# EAGLE design Qwiic-CO2_Sensor-SCD40 (EAGLE 9.6.2)
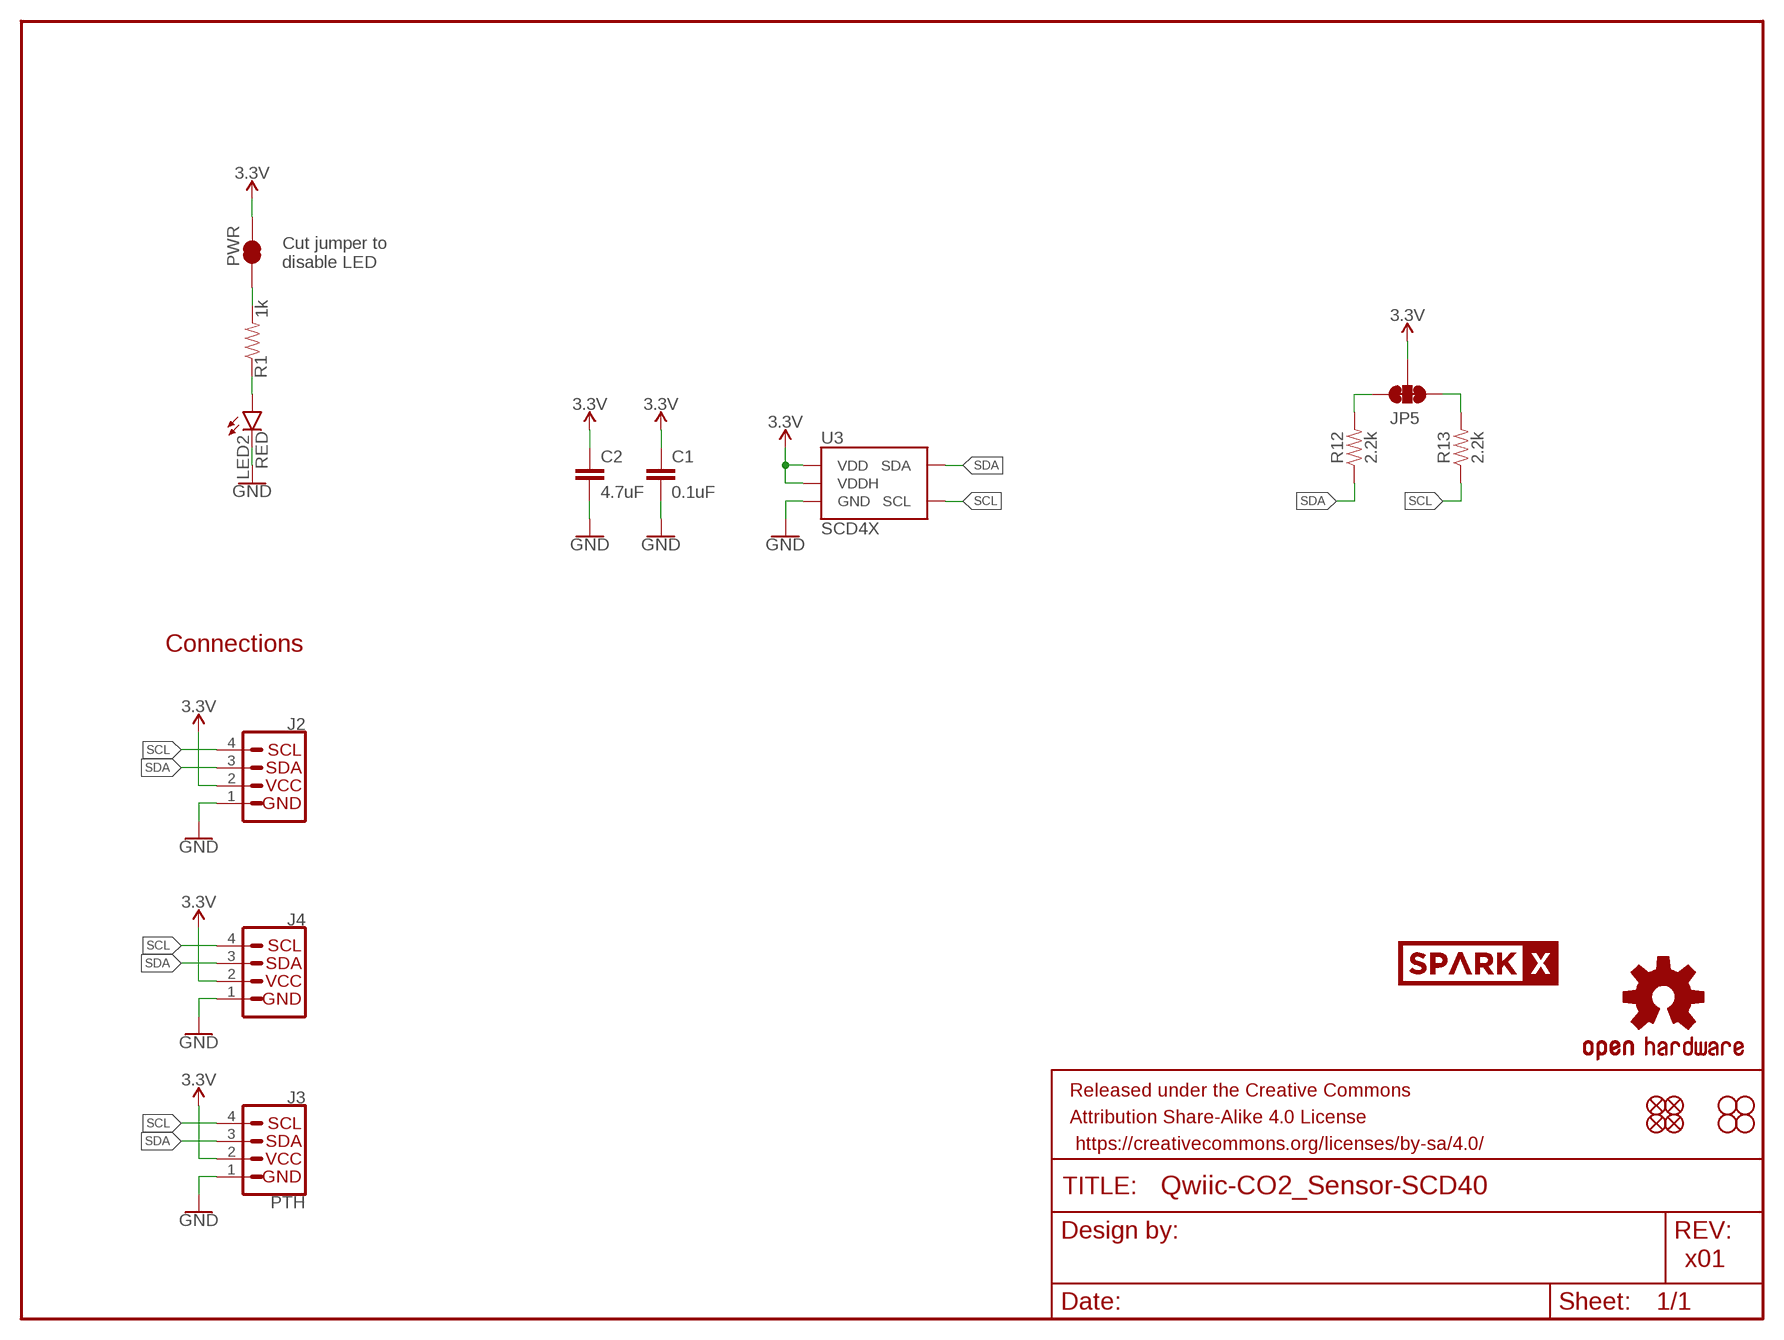
[diagram p0: schematic, sheet 1]

## Parts
C1  0.1uF  0.1UF-0603-25V-(+80/-20%)  [0603]
C2  4.7uF  4.7UF-0603-6.3V-(10%)  [0603]
FRAME1  FRAME-LETTER  [CREATIVE_COMMONS]
J2  Qwiic Right Angle  I2C_STANDARDQWIIC  [JST04_1MM_RA]
J3  PTH  I2C_STANDARD_NO_SILK  [1X04_NO_SILK]
J4  Qwiic Right Angle  I2C_STANDARDQWIIC  [JST04_1MM_RA]
JP5  JUMPER-SMT_3_2-NC_TRACE_SILK  [SMT-JUMPER_3_2-NC_TRACE_SILK]
JP21  FIDUCIALUFIDUCIAL  [MICRO-FIDUCIAL]
JP31  STAND-OFF  [STAND-OFF]
JP41  STAND-OFF  [STAND-OFF]
JP61  FIDUCIALUFIDUCIAL  [MICRO-FIDUCIAL]
JP71  FIDUCIALUFIDUCIAL  [MICRO-FIDUCIAL]
JP81  FIDUCIALUFIDUCIAL  [MICRO-FIDUCIAL]
JP91  STAND-OFF  [STAND-OFF]
JP101  STAND-OFF  [STAND-OFF]
LED2  RED  LED-RED0603  [LED-0603]
LOGO1  OSHW-LOGOMINI  [OSHW-LOGO-MINI]
PWR  JUMPER-SMT_2_NC_TRACE_SILK  [SMT-JUMPER_2_NC_TRACE_SILK]
R1  1k  1KOHM-0603-1/10W-1%  [0603]
R12  2.2k  2.2KOHM-0603-1/10W-1%  [0603]
R13  2.2k  2.2KOHM-0603-1/10W-1%  [0603]
U3  SCD4X  [SCD4X]
U$5  SPARKX-LOGO4  [SPARKX-MEDIUM]

## Nets
3.3V [3.3V]: C1.1 C2.1 J2.2 J3.2(VCC) J4.2 JP5.2 PWR.2 U3.7(VDD) U3.19(VDDH)
GND: C1.2 C2.2 J2.1 J3.1(GND) J4.1 LED2.C U3.6(GND) U3.20(GND) U3.CP(GND)
N$9: JP5.1 R13.2
N$10: LED2.A R1.1
N$15: JP5.3 R12.2
N$17: PWR.1 R1.2
SCL: J2.4 J3.4(SCL) J4.4 R13.1 U3.9(SCL)
SDA: J2.3 J3.3(SDA) J4.3 R12.1 U3.10(SDA)

## Notes on the sheet
- Cut jumper to 
  disable LED
- Connections
- x01

## Library data of the parts
C1 = SparkFun-Capacitors:0.1UF: 0.1µF ceramic capacitors A capacitor is a passive two-terminal electrical component used to store electrical energy temporarily in an electric field.; PROD_ID: CAP-00810
C2 = SparkFun-Capacitors:4.7UF: 4.7µF ceramic capacitors A capacitor is a passive two-terminal electrical component used to store electrical energy temporarily in an electric field.; PROD_ID: CAP-08280
FRAME1 = SparkFun-Aesthetics:FRAME-LETTER: Schematic Frame - Letter Standard 8.5x11 US Letter frame
J2 J4 = SparkFun-Connectors:I2C_STANDARD: SparkFun I2C Standard Pinout Header SparkFun has standardized on a pinout for all I2C based sensor breakouts. This pinout allows I2C boards to be plugged directly into the headers on Arduino Uno compatible boards, and to be daisy chained easily. Example SparkFun Products: SparkFun Atmospheric Sensor Breakout - BME280 <https://www.sparkfun.com/products/13676> SparkFun Altitude/Pressure Sensor Breakout - MPL3115A2 <https://www.sparkfun.com/products/11084> SparkFun TOF Range Finder Sensor - VL6180 <https://www.sparkfun.com/products/12785>; PROD_ID: CONN-13694
J3 = SparkX:I2C_STANDARD: SparkFun I2C Standard Pinout Header SparkFun has standardized on a pinout for all I2C based sensor breakouts. This pinout allows I2C boards to be plugged directly into the headers on Arduino Uno compatible boards, and to be daisy chained easily. Example SparkFun Products: SparkFun Atmospheric Sensor Breakout - BME280 <https://www.sparkfun.com/products/13676> SparkFun Altitude/Pressure Sensor Breakout - MPL3115A2 <https://www.sparkfun.com/products/11084> SparkFun TOF Range Finder Sensor - VL6180 <https://www.sparkfun.com/products/12785>
JP5 = SparkFun-Jumpers:JUMPER-SMT_3_2-NC_TRACE: Normally closed trace jumper (2 of 2 connections) This jumper has a trace between all three pads so they are normally closed (NC). Use a razor knife to open the connection(s). For best results follow the IPC guidelines for cutting traces: Cutout at least 0.063 mm (0.005 in). Remove all loose material to clean up the cut area. Seal the cut with an approved epoxy. Reapply solder to reclose the connection(s).
JP21 JP61 JP71 JP81 = SparkFun:FIDUCIAL: Fiducial Alignment Points Various fiducial points for machine vision alignment.
JP31 JP41 JP91 JP101 = SparkFun:STAND-OFF: Stand Off This is the mechanical footprint for a #4 phillips button head screw. Use the keepout ring to avoid running the screw head into surrounding components. SKU : PRT-00447
LED2 = SparkFun-LED:LED-RED: Red SMD LED Used in manufacturing of most products at SparkFun Packages: 0603 - SMD 0603 package [Product Link] <http://docs.avagotech.com/docs/AV02-0551EN> 0603 SMART - SMD 0603 SMART package ( more efficient and expensive)[Product Link] <http://www.osram-os.com/Graphics/XPic2/00077099_0.pdf> 1206 - SMD1206 package [Product Link] <https://www.sparkfun.com/datasheets/DevTools/LilyPad/Q150OVS4.pdff> SparkFun Products: Pro Mini 328 -5V <https://www.sparkfun.com/products/821> RedBoard <https://www.sparkfun.com/products/12757> IOIO-OTG <https://www.sparkfun.com/products/13613>; PROD_ID: DIO-00819
LOGO1 = SparkFun-Aesthetics:OSHW-LOGO: Open-Source Hardware (OSHW) Logo This logo indicates the piece of hardware it is found on incorporates a OSHW license and/or adheres to the definition of open source hardware found here: http://freedomdefined.org/OSHW
PWR = SparkFun-Jumpers:JUMPER-SMT_2_NC_TRACE: Normally closed trace jumper This jumper has a trace between two pads so it's normally closed (NC). Use a razor knife to open the connection. For best results follow the IPC guidelines for cutting traces: Cutout at least 0.063 mm (0.005 in). Remove all loose material to clean up the cut area. Seal the cut with an approved epoxy. Reapply solder to reclose the connection.
R1 = SparkFun-Resistors:1KOHM: 1kΩ resistor A resistor is a passive two-terminal electrical component that implements electrical resistance as a circuit element. Resistors act to reduce current flow, and, at the same time, act to lower voltage levels within circuits. - Wikipedia; PROD_ID: RES-07856
R12 R13 = SparkFun-Resistors:2.2KOHM: 2.2kΩ resistor A resistor is a passive two-terminal electrical component that implements electrical resistance as a circuit element. Resistors act to reduce current flow, and, at the same time, act to lower voltage levels within circuits. - Wikipedia; PROD_ID: RES-08272
U3 = NewParts:SCD4X: The SGP40 is a digital gas sensor designed for easy integration into air purifiers or demand-controlled ventilation systems.
U$5 = SparkX:SPARKX-LOGO

## Net classes
1 power: width 0.178 mm
2 3.3V: width 0.305 mm
3 RF: width 0.35 mm, clearance 0.203 mm

## Board
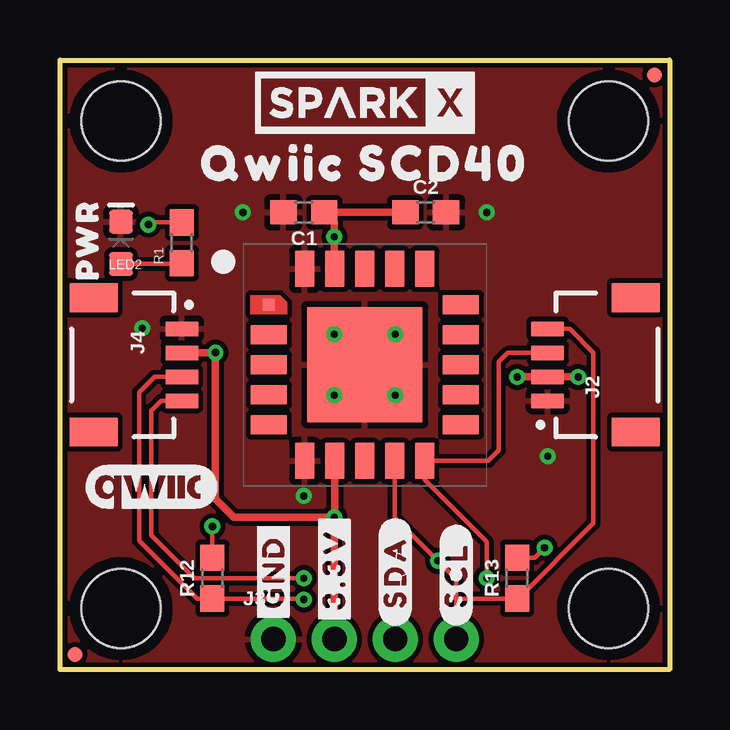
[diagram p1: board, top side]
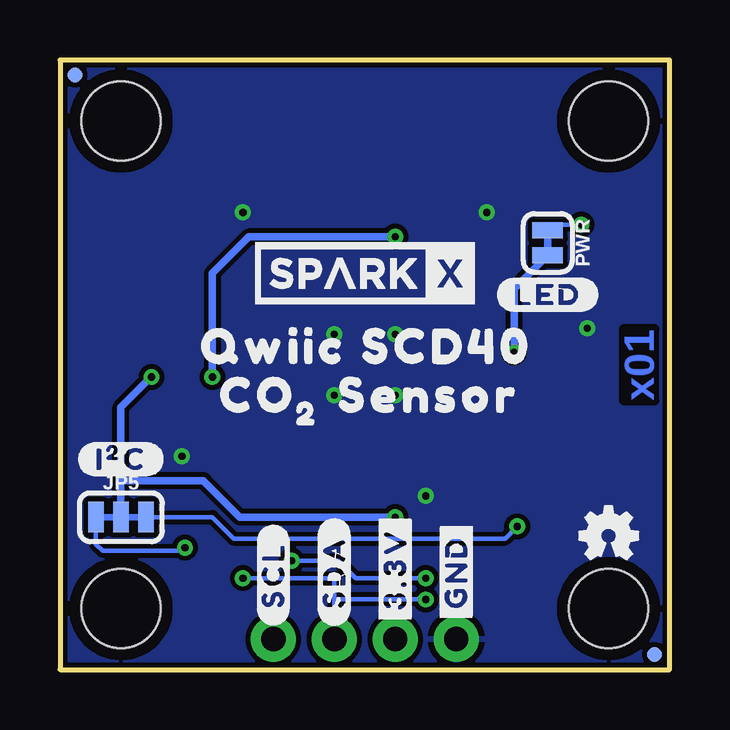
[diagram p2: board, bottom side, seen from below]

Size 25.4 x 25.4 mm. Coordinates in mm from the lower left corner, seen from the top.
Outline: 25.4,0 0,0 0,25.4 25.4,25.4 25.4,0
Copper layers (1*16): Top 0.035mm / dielectric 1.5mm / Bottom 0.035mm
Design rules "SparkFun-2-Layer-General-JLCPCB": minimum track width 7mil, minimum drill 0.3mm, track to track 7mil, track to pad 7mil, pad to pad 7mil, via to via 7mil, smd to smd 7mil, copper to edge 7mil, drill to drill 7mil, minimum pad ring 7mil, minimum via ring 7mil, stop-mask expansion 4mil, vias tented up to drill 25mil, thermal gap 10mil

### Footprints (pad centres in the part's own frame; a part is rotated, then mirrored left to right if it is on the bottom)
0603 = smd 1.1 x 1: 1 -0.85,0; 2 0.85,0
JST04_1MM_RA = smd 0.6 x 1.35: 1 -1.5,0; 2 -0.5,0; 3 0.5,0; 4 1.5,0 | smd 1.2 x 2: NC1 2.8,-3.675; NC2 -2.8,-3.675
1X04_NO_SILK = drill 1.016 pad 1.88: 1 0,0; 2 2.54,0; 3 5.08,0; 4 7.62,0
SMT-JUMPER_3_2-NC_TRACE_SILK = smd 0.66 x 1.27: 1 -1.041,0; 2 0,0; 3 1.041,0
MICRO-FIDUCIAL = smd 0.635 x 0.635: 1 0,0
STAND-OFF = hole 3.302: 0,0
LED-0603 = smd 1 x 1: A -0.877,0; C 0.877,0
SMT-JUMPER_2_NC_TRACE_SILK = smd 0.66 x 1.27: 1 -0.521,0; 2 0.521,0
SCD4X = smd 0.5 x 0.5: 1 -4,2.5 | smd 1.5 x 0.8: 2 -4,1.25; 3 -4,0; 4 -4,-1.25; 5 -4,-2.5; 11 4,-2.5; 12 4,-1.25; 13 4,0; 14 4,1.25; 15 4,2.5 | smd 0.8 x 1.5: 6 -2.5,-4; 7 -1.25,-4; 8 0,-4; 9 1.25,-4; 10 2.5,-4; 16 2.5,4; 17 1.25,4; 18 0,4; 19 -1.25,4; 20 -2.5,4 | smd 4.8 x 4.8: CP 0,0

### Placement (x,y rotation side)
C1  10.16,19.05 180 top
C2  15.24,19.05 0 top
FRAME1  8.89,-17.78 0 top  (outside the outline)
J2  20.32,12.7 90 top
J3  8.89,1.27 0 top
J4  5.08,12.7 270 top
JP5  22.86,6.35 0 bottom
JP21  24.77,24.77 90 top
JP31  2.54,2.54 90 top
JP41  2.54,22.86 90 top
JP61  0.64,0.64 90 top
JP71  24.77,24.77 270 bottom
JP81  0.64,0.64 270 bottom
JP91  22.86,2.54 90 top
JP101  22.86,22.86 90 top
LED2  2.54,17.78 90 top
LOGO1  2.54,5.59 0 bottom
PWR  5.08,17.78 270 bottom
R1  5.08,17.78 90 top
R12  6.35,3.81 90 top
R13  19.05,3.81 90 top
U3  12.7,12.7 0 top
U$1  [CO1]  17.14,11.43 0 bottom
U$2  [SCD400]  16,21.08 0 top
U$3  [QWIIC0]  8.89,21.08 0 top
U$4  [QWIIC0]  16.51,13.46 0 bottom
U$5  12.7,23.62 0 top
U$6  [#3#3V#0]  11.43,4.19 90 bottom
U$7  [#SDA#0]  13.97,4.06 90 bottom
U$8  [#SCL#0]  16.51,3.94 90 bottom
U$9  [#GND#0]  8.89,4.06 90 bottom
U$10  [#I�C#1]  22.86,8.76 0 bottom
U$11  [SCD400]  9.27,13.46 0 bottom
U$12  [PWR0]  1.14,17.91 90 top
U$13  [SENSOR3]  10.03,11.43 0 bottom
U$14  [20]  15.11,10.67 0 bottom
U$23  [#LED#0]  5.08,15.62 0 bottom
U$33  [#GND#0]  8.89,4.06 90 top
U$34  [#3#3V#0]  11.43,4.19 90 top
U$35  [#SDA#0]  13.97,4.06 90 top
U$36  [#SCL#0]  16.51,3.94 90 top
U$38  SPARKX-LOGO4  [SPARKX-MEDIUM]  12.7,16.51 0 bottom
U$42  [QWIIC_5.5MM]  3.81,7.62 0 top

### Tracks (layer width: path | path; a pad name or v marks a point on that pad's centre or on a via)
3.3V  (via drill 0.3)
  Top 0.305: J4.2 v6.47,13.2 v6.48,13.21 6.48,7.11 7.24,6.35 v11.43,6.35 | v19.05,12.19 J2.2 v21.58,12.2 v21.59,12.19 | U3.7 11.45,6.37 v11.43,6.35 | J3.2 v11.43,6.35 | C2.1 C1.1 11.43,18.63 v11.43,18.03 11.43,16.72 U3.19
  Bottom 0.305: v11.43,18.03 17.53,18.03 19.05,16.51 v19.05,12.19 | JP5.2 22.86,7.87 | 22.86,7.87 22.86,10.92 v21.59,12.19 | 22.86,7.87 19.43,7.87 17.91,6.35 v11.43,6.35 | v6.48,13.21 6.48,15.86 PWR.2
GND  (via drill 0.3)
  other vias: 3.43,14.22 10.16,7.24 11.43,13.97 13.97,13.97 13.97,11.43 11.43,11.43 20.32,8.89 7.62,19.05 17.78,19.05
  pour Top (isolate 0.203, rank 4): 0,0 0,25.4 25.4,25.4 25.4,0
  pour Bottom (isolate 0.203, rank 4): 0,0 0,25.4 25.4,25.4 25.4,0
N$9  (via drill 0.3)
  Top 0.178: v20.19,5.08 19.77,4.66 R13.2
  Bottom 0.178: JP5.1 23.9,5.23 23.62,4.95 20.32,4.95 v20.19,5.08
N$10
  Top 0.178: LED2.A 5.05,16.9 R1.1
N$15  (via drill 0.3)
  Top 0.178: v6.35,5.97 R12.2
  Bottom 0.178: JP5.3 19.05,6.35 18.16,5.46 6.86,5.46 v6.35,5.97
N$17  (via drill 0.3)
  Top 0.178: R1.2 3.77,18.63 v3.68,18.54
  Bottom 0.178: v3.68,18.54 4.84,18.54 PWR.1
SCL  (via drill 0.3)
  Top 0.178: J3.4 16.51,2.92 | J4.4 4.21,11.2 3.81,10.79 3.81,5.59 5.59,3.81 v10.16,3.81 | 16.51,2.92 16.55,2.96 R13.1 19.09,2.96 22.23,6.1 22.23,13.21 21.23,14.2 J2.4 | U3.9 13.95,6.33 v15.75,4.53 16.51,3.77 16.51,2.92
  Bottom 0.178: v15.75,4.53 13.81,4.53 13.09,3.81 v10.16,3.81
SDA  (via drill 0.3)
  Top 0.178: v17.78,3.81 17.78,5.33 15.2,7.91 U3.10 17.84,8.7 18.29,9.14 18.29,12.83 18.66,13.2 J2.3 | v10.16,2.92 10.12,2.96 R12.1 5.71,2.96 3.3,5.37 3.3,11.56 3.94,12.2 J4.3
  Bottom 0.178: v17.78,3.81 13.97,3.81 13.97,2.92 | 13.97,2.92 J3.3 | v10.16,2.92 13.97,2.92

### Text on the board
Bottom: x01
Measures: Measurements in inches